# EAGLE design LatarDetect (EAGLE 9.5.1)
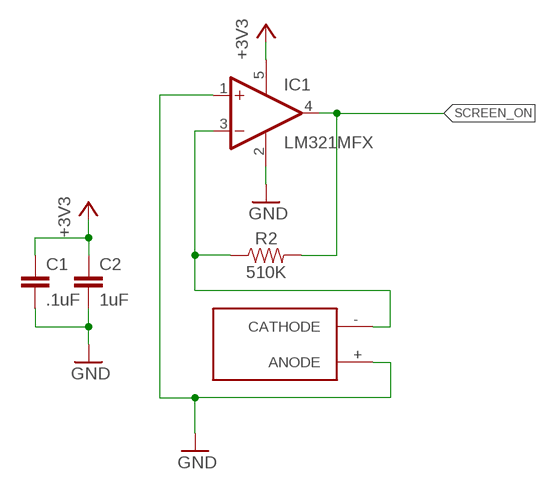
[diagram p0: schematic, sheet 1]

## Parts
C1  .1uF  C-EUC0805  [C0805]
C2  1uF  C-EUC0805  [C0805]
IC1  LM321MFX  [SOT23-5]
R2  510K  RESISTOR0805  [0805]
U$1  BPW34S-Z  [BPW34S-Z]

## Nets
+3V3: C1.1 C2.1 IC1.5(V+)
GND: C1.2 C2.2 IC1.1(+IN) IC1.2(V-) U$1.+(ANODE)
N$1: IC1.3(-IN) R2.1 U$1.-(CATHODE)
SCREEN_ON: IC1.4(OUT) R2.2

## Library data of the parts
C1 C2 = rcl:C-EU: CAPACITOR, European symbol
IC1 = linear:LM321?*: Low Power Single Op Amp Source: http://cache.national.com/ds/LM/LM321.pdf
R2 = SparkFun-Resistors:RESISTOR: Generic Resistor Package
U$1 = poe:BPW34S-Z

## Board
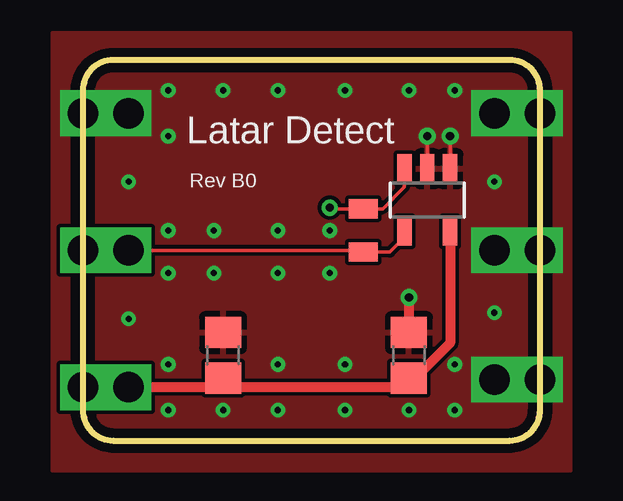
[diagram p1: board, top side]
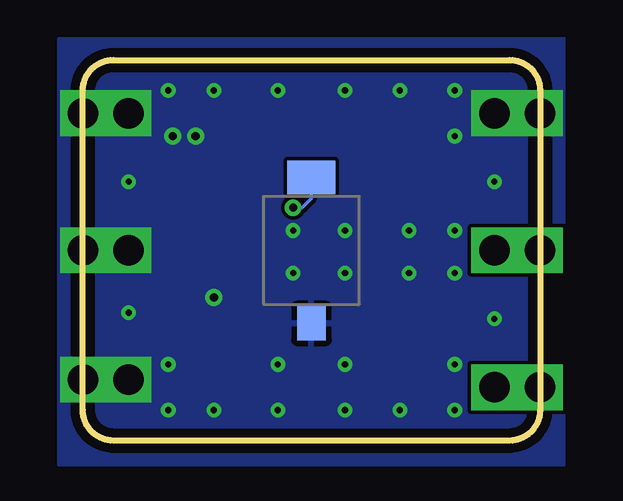
[diagram p2: board, bottom side, seen from below]

Size 19.05 x 15.88 mm. Coordinates in mm from the lower left corner, seen from the top.
Outline: 19.05,1.27 19.05,14.61 arc90 17.78,15.88 1.27,15.88 arc90 0,14.61 0,1.27 arc90 1.27,0 17.78,0 arc90 19.05,1.27
Copper layers (1*16): Top 0.0356mm / dielectric 1.5011mm / Bottom 0.0356mm
Design rules "LaenPCBOrder": minimum track width 6mil, minimum drill 13mil, track to track 6mil, track to pad 6mil, pad to pad 6mil, via to via 6mil, smd to smd 6mil, copper to edge 15mil, drill to drill 6mil, minimum pad ring 7mil, minimum via ring 7mil, stop-mask expansion 3mil, vias tented up to drill 0mil, thermal gap 10mil

### Footprints (pad centres in the part's own frame; a part is rotated, then mirrored left to right if it is on the bottom)
C0805 = smd 1.3 x 1.5: 1 -0.95,0; 2 0.95,0
SOT23-5 = smd 0.6 x 1.2: 1 -0.95,-1.306; 2 0,-1.306; 3 0.95,-1.306; 4 0.95,1.306; 5 -0.95,1.306
0805 = smd 0.8 x 1.2: 1 -0.9,0; 2 0.9,0
BPW34S-Z = smd 1.4 x 1.2: + -3.05,0 | smd 1.4 x 2: - 3.05,0

### Placement (x,y rotation side)
C1  13.59,3.56 90 top
C2  5.84,3.56 90 top
IC1  14.35,10.03 180 top
R2  11.68,8.76 270 top
U$1  9.53,7.94 90 bottom

### Tracks (layer width: path | path; a pad name or v marks a point on that pad's centre or on a via)
+3V3  (via drill 1.27)
  Top 0.406: 5.52,2.23 0.96,2.23 v1.91,2.22 v0,2.22 | 5.52,2.23 13.78,2.23 C1.1 13.84,2.61 15.3,4.06 IC1.5 | 5.52,2.23 C2.1
GND  (via drill 0.25, 0.35, 1.27)
  Top 0.152: IC1.1 15.3,12.57 v15.3,12.7 | v14.35,12.7 IC1.2
  Top 0.406: v13.59,5.97 C1.2 | v0,13.65 v1.91,13.65 | v19.05,2.54 v17.14,2.54 | v19.05,7.94 v17.14,7.94 | v19.05,13.65 v17.14,13.65
  other vias: 3.56,8.76 3.56,6.99 5.46,6.99 5.46,8.76 8.13,8.76 8.13,6.99 10.29,6.99 10.29,8.76 3.56,3.17 3.56,1.27 8.13,1.27 8.13,3.17 10.92,3.17 10.92,1.27 5.84,1.27 13.59,1.27 15.49,3.17 15.49,1.27 17.14,5.33 3.56,14.61 5.84,14.61 8.13,14.61 10.92,14.61 13.59,14.61 15.49,14.61 3.56,12.7 1.91,10.79 1.91,5.08 17.14,10.79
  pour Top: -1.27,-1.27 -1.27,17.02 20.32,17.02 20.32,-1.27
  pour Bottom: -1.02,-1.02 -1.02,16.76 20.07,16.76 20.07,-1.02
N$1  (via drill 0.33)
  Top 0.152: IC1.3 13.4,10.58 12.49,9.66 R2.1 10.34,9.66 v10.29,9.72
  Bottom 0.152: 9.72,10.99 U$1.- 9.53,10.1 9.91,9.72 v10.29,9.72
SCREEN_ON  (via drill 1.27)
  Top 0.152: 11.44,7.89 R2.2 | IC1.4 13.4,8.47 12.79,7.86 R2.2 | R2.2 11.56,7.94 1.96,7.94 v1.91,7.94
  Top 0.406: v0,7.94 v1.91,7.94

### Text on the board
tPlace: Latar Detect | Rev B0